# Altium schematic sheet 飞控.SchDoc
size A4
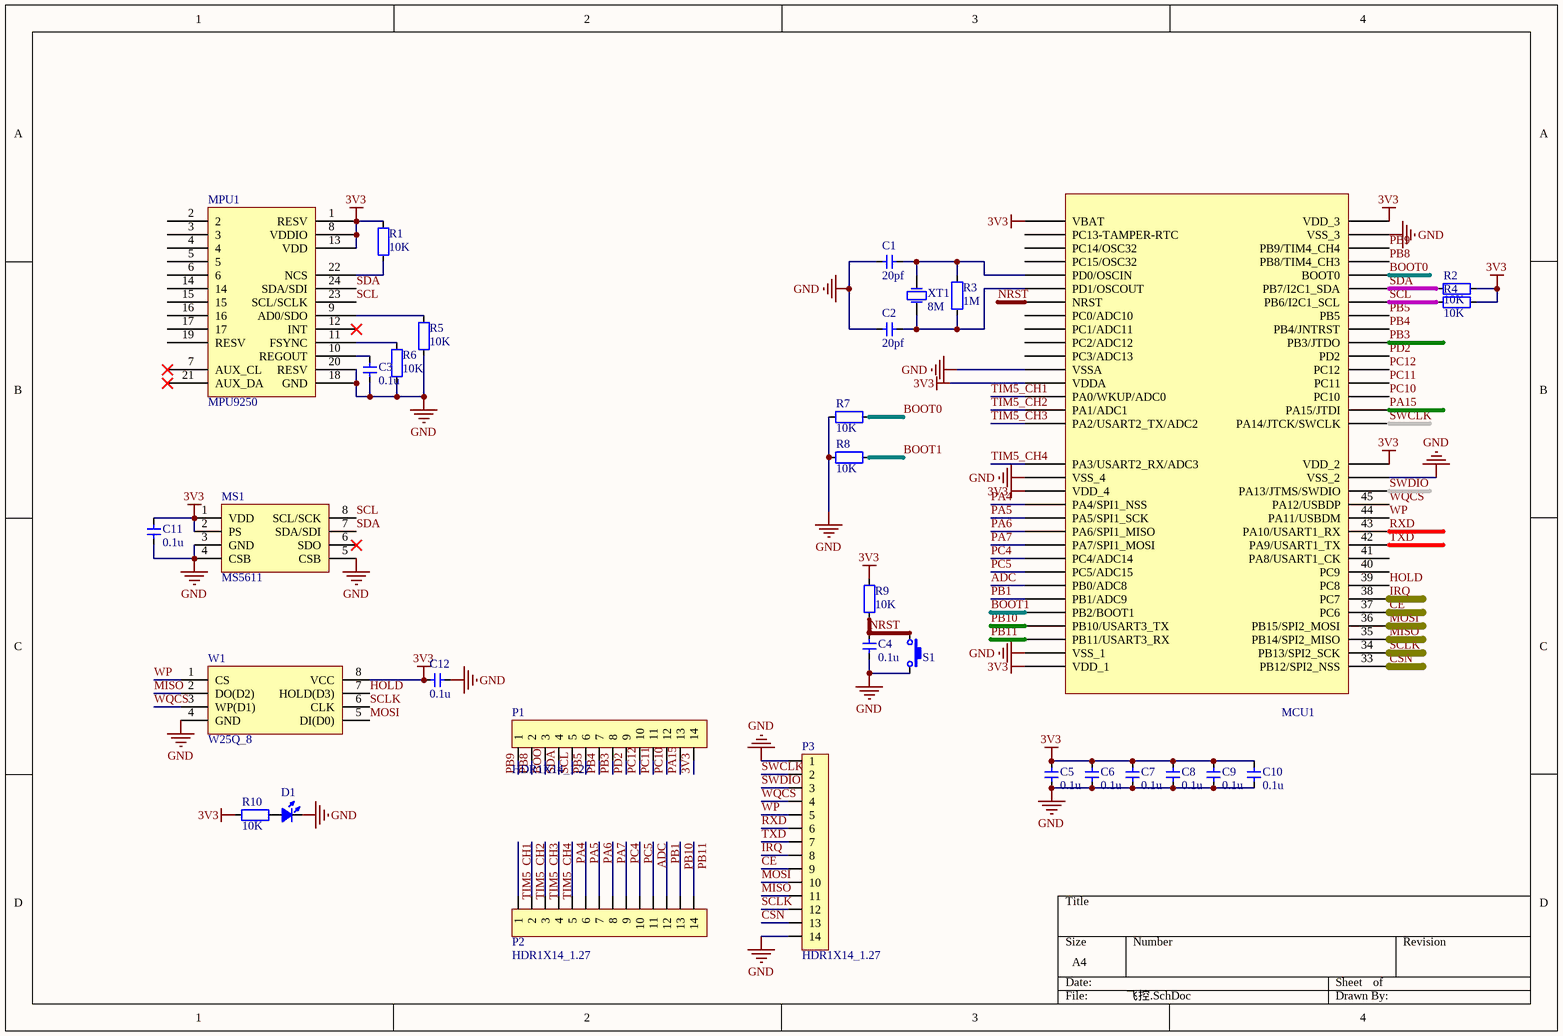
[diagram p0: 飞控.SchDoc]

## Parts
C1  value 20pf  [CAP_0603]  (hidden comment: Cap_0603)
C2  value 20pf  [CAP_0603]  (hidden comment: Cap_0603)
C3  value 0.1u  [CAP_0603]  (hidden comment: Cap_0603)
C4  value 0.1u  [CAP_0603]  (hidden comment: Cap_0603)
C5  value 0.1u  [CAP_0603]  (hidden comment: Cap_0603)
C6  value 0.1u  [CAP_0603]  (hidden comment: Cap_0603)
C7  value 0.1u  [CAP_0603]  (hidden comment: Cap_0603)
C8  value 0.1u  [CAP_0603]  (hidden comment: Cap_0603)
C9  value 0.1u  [CAP_0603]  (hidden comment: Cap_0603)
C10  value 0.1u  [CAP_0603]  (hidden comment: Cap_0603)
C11  value 0.1u  [CAP_0603]  (hidden comment: Cap_0603)
C12  value 0.1u  [CAP_0603]  (hidden comment: Cap_0603)
D1  LED_0805  [LED_0805_RED]  (value not drawn)
MCU1  STM32F103RC  [LQFP_P0.5_64]  (value not drawn)
MPU1  MPU9250  [QFN_P0.4_24]
MS1  MS5611  [OTHER_MS5611_8]
P1  HDR1X14_1.27  [HDR1X14_1.27]
P2  HDR1X14_1.27  [HDR1X14_1.27]
P3  HDR1X14_1.27  [HDR1X14_1.27]
R1  value 10K  [RES_0603]  (hidden comment: Res_0603)
R2  value 10K  [RES_0603]  (hidden comment: Res_0603)
R3  value 1M  [RES_0603]  (hidden comment: Res_0603)
R4  value 10K  [RES_0603]  (hidden comment: Res_0603)
R5  value 10K  [RES_0603]  (hidden comment: Res_0603)
R6  value 10K  [RES_0603]  (hidden comment: Res_0603)
R7  value 10K  [RES_0603]  (hidden comment: Res_0603)
R8  value 10K  [RES_0603]  (hidden comment: Res_0603)
R9  value 10K  [RES_0603]  (hidden comment: Res_0603)
R10  value 10K  [RES_0603]  (hidden comment: Res_0603)
S1  ButtonTACT_3x4x2_180  [ButtonTACT_3x4x2_180H]  (value not drawn)
W1  W25Q_8  [SOIC_E200_8]
XT1  value 8M  [XT_5032_2]  (hidden comment: XTAL_5032_2P)

## Nets
3V3: C5.2 C6.2 C7.2 C8.2 C9.2 C10.2 C11.2 C12.1 MCU1.1(VBAT) MCU1.13(VDDA) MCU1.19(VDD_4) MCU1.32(VDD_1) MCU1.48(VDD_2) MCU1.64(VDD_3) MPU1.1(RESV) MPU1.8(VDDIO) MPU1.13(VDD) MS1.1(VDD) MS1.2(PS) P1.14 R1.1 R2.2 R4.2 R9.1 R10.1 W1.8(VCC)
GND: C1.1 C2.1 C3.2 C4.1 C5.1 C6.1 C7.1 C8.1 C9.1 C10.1 C11.1 C12.2 D1.2(K) MCU1.12(VSSA) MCU1.18(VSS_4) MCU1.31(VSS_1) MCU1.47(VSS_2) MCU1.63(VSS_3) MPU1.18(GND) MPU1.20(RESV) MS1.3(GND) MS1.4(CSB) MS1.5(CSB) P3.1 P3.14 R5.2 R6.2 R7.2 R8.2 S1.2 W1.4(GND)
ADC: MCU1.26(PB0/ADC8) P2.11
BOOT0: MCU1.60(BOOT0) P1.3 R7.1
BOOT1: MCU1.28(PB2/BOOT1) R8.1
CE: MCU1.37(PC6) P3.9
CSN: MCU1.33(PB12/SPI2_NSS) P3.13
HOLD: MCU1.39(PC8) W1.7(HOLD(D3))
IRQ: MCU1.38(PC7) P3.8
MISO: MCU1.35(PB14/SPI2_MISO) P3.11 W1.2(DO(D2))
MOSI: MCU1.36(PB15/SPI2_MOSI) P3.10 W1.5(DI(D0))
NRST: C4.2 MCU1.7(NRST) R9.2 S1.1
PA4: MCU1.20(PA4/SPI1_NSS) P2.5
PA5: MCU1.21(PA5/SPI1_SCK) P2.6
PA6: MCU1.22(PA6/SPI1_MISO) P2.7
PA7: MCU1.23(PA7/SPI1_MOSI) P2.8
PA15: MCU1.50(PA15/JTDI) P1.13
PB1: MCU1.27(PB1/ADC9) P2.12
PB3: MCU1.55(PB3/JTDO) P1.8
PB4: MCU1.56(PB4/JNTRST) P1.7
PB5: MCU1.57(PB5) P1.6
PB8: MCU1.61(PB8/TIM4_CH3) P1.2
PB9: MCU1.62(PB9/TIM4_CH4) P1.1
PB10: MCU1.29(PB10/USART3_TX) P2.13
PB11: MCU1.30(PB11/USART3_RX) P2.14
PC4: MCU1.24(PC4/ADC14) P2.9
PC5: MCU1.25(PC5/ADC15) P2.10
PC10: MCU1.51(PC10) P1.12
PC11: MCU1.52(PC11) P1.11
PC12: MCU1.53(PC12) P1.10
PD2: MCU1.54(PD2) P1.9
RXD: MCU1.43(PA10/USART1_RX) P3.6
SCL: MCU1.58(PB6/I2C1_SCL) MPU1.23(SCL/SCLK) MS1.8(SCL/SCK) P1.5 R4.1
SCLK: MCU1.34(PB13/SPI2_SCK) P3.12 W1.6(CLK)
SDA: MCU1.59(PB7/I2C1_SDA) MPU1.24(SDA/SDI) MS1.7(SDA/SDI) P1.4 R2.1
SWCLK: MCU1.49(PA14/JTCK/SWCLK) P3.2
SWDIO: MCU1.46(PA13/JTMS/SWDIO) P3.3
TIM5_CH1: MCU1.14(PA0/WKUP/ADC0) P2.1
TIM5_CH2: MCU1.15(PA1/ADC1) P2.2
TIM5_CH3: MCU1.16(PA2/USART2_TX/ADC2) P2.3
TIM5_CH4: MCU1.17(PA3/USART2_RX/ADC3) P2.4
TXD: MCU1.42(PA9/USART1_TX) P3.7
WP: MCU1.44(PA11/USBDM) P3.5 W1.1(CS)
WQCS: MCU1.45(PA12/USBDP) P3.4 W1.3(WP(D1))
NetC1_2: C1.2 MCU1.5(PD0/OSCIN) R3.2 XT1.2(OSC2)
NetC2_2: C2.2 MCU1.6(PD1/OSCOUT) R3.1 XT1.1(OSC1)
NetC3_1: C3.1 MPU1.10(REGOUT)
NetD1_1: D1.1(A) R10.2
NetMPU1_9: MPU1.9(AD0/SDO) R5.1
NetMPU1_11: MPU1.11(FSYNC) R6.1
NetMPU1_22: MPU1.22(NCS) R1.2

Not connected (* = marked no-connect by the designer): MCU1 2(PC13-TAMPER-RTC) 3(PC14/OSC32) 4(PC15/OSC32) 8(PC0/ADC10) 9(PC1/ADC11) 10(PC2/ADC12) 11(PC3/ADC13) 40(PC9) 41(PA8/USART1_CK); MPU1 2 3 4 5 6 7(AUX_CL)* 12(INT)* 14 15 16 17 19(RESV) 21(AUX_DA)*; MS1 6(SDO)*

## Library data of the parts
C1-C12 = Cap_0603: Capacitor
D1 = LED_0805: LED
MCU1 = STM32F103RC: MCU
MS1 = MS5611: Sensor
R1-R10 = Res_0603: Resistor
S1 = ButtonTACT_3x4x2_180: Button
W1 = W25Q_8: FLASH
XT1 = XTAL_5032_2P: Crystal Oscillator